# EAGLE design Arduino_EG (EAGLE 9.0.1)
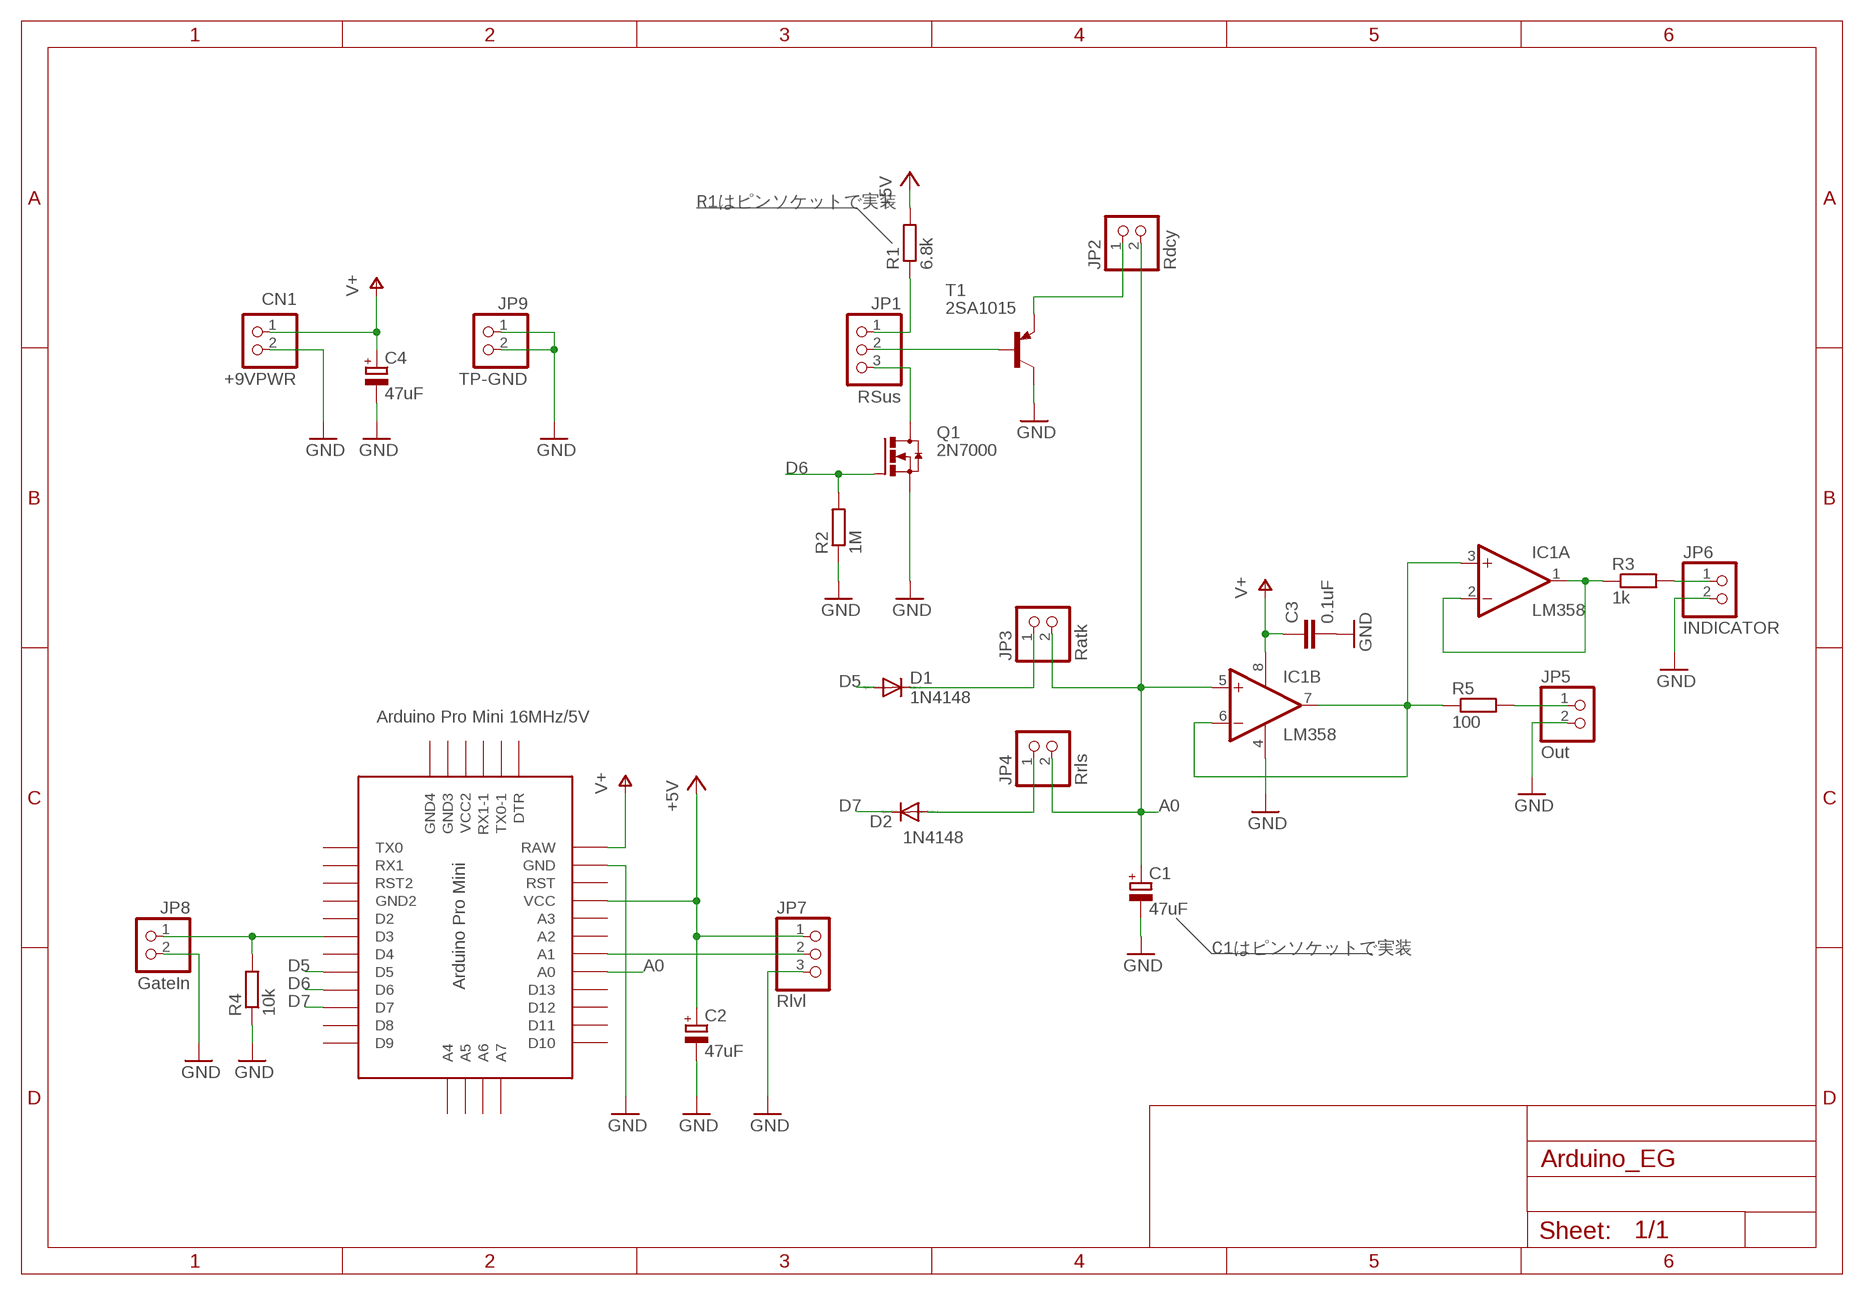
[diagram p0: schematic, sheet 1]

## Parts
C1  47uF  CPOL-EUE2.5-7  [E2,5-7]
C2  47uF  CPOL-EUE2.5-7  [E2,5-7]
C3  0.1uF  C-EU025-025X050  [C025-025X050]
C4  47uF  CPOL-EUE2.5-7  [E2,5-7]
CN1  +9VPWR  B2B-XH-A  [B2B-XH-A]
D1  1N4148  1N4148DO35-7  [DO35-7]
D2  1N4148  1N4148DO35-7  [DO35-7]
IC1  LM358  LM358N  [DIL08]
JP1  RSus  PINHD-1X3  [1X03]
JP2  Rdcy  PINHD-1X2  [1X02]
JP3  Ratk  PINHD-1X2  [1X02]
JP4  Rrls  PINHD-1X2  [1X02]
JP5  Out  PINHD-1X2  [1X02]
JP6  INDICATOR  PINHD-1X2  [1X02]
JP7  Rlvl  PINHD-1X3  [1X03]
JP8  GateIn  PINHD-1X2  [1X02]
JP9  TP-GND  PINHD-1X2  [1X02]
Q1  2N7000  [TO92-]
R1  6.8k  R-EU_0207/7  [0207/7]
R2  1M  R-EU_0207/7  [0207/7]
R3  1k  R-EU_0207/7  [0207/7]
R4  10k  R-EU_0207/7  [0207/7]
R5  100  R-EU_0207/7  [0207/7]
T1  2SA1015  -PNP-TO92-ECB  [TO92-ECB]
U$1  PRO-MINI  [PRO-MINI]

## Nets
+5V: C2.+ JP7.1 R1.2 U$1.VCC
A0: C1.+ IC1.5(B:+IN) JP2.2 JP3.2 JP4.2 U$1.A0
D5: D1.A U$1.D5
D6: Q1.2(G) R2.2 U$1.D6
D7: D2.C U$1.D7
GND: C1.- C2.- C3.2 C4.- CN1.2 IC1.4(P:V-) JP5.2 JP6.2 JP7.3 JP8.2 JP9.1 JP9.2 Q1.3(S) R2.1 R4.1 T1.C U$1.GND
N$1: JP1.1 R1.1
N$2: JP1.3 Q1.1(D)
N$3: JP1.2 T1.B
N$4: JP2.1 T1.E
N$5: JP5.1 R5.2
N$6: D1.C JP3.1
N$8: D2.A JP4.1
N$9: IC1.1(A:OUT) IC1.2(A:-IN) R3.1
N$10: JP7.2 U$1.A1
N$11: JP6.1 R3.2
N$13: JP8.1 R4.2 U$1.D3
OUT: IC1.3(A:+IN) IC1.6(B:-IN) IC1.7(B:OUT) R5.1
V+: C3.1 C4.+ CN1.1 IC1.8(P:V+) U$1.RAW
Unconnected: U$1.A2 U$1.A3 U$1.A4 U$1.A5 U$1.A6 U$1.A7 U$1.D2 U$1.D4 U$1.D8 U$1.D9 U$1.D10 U$1.D11 U$1.D12 U$1.D13 U$1.DTR U$1.GND1(GND2) U$1.GND2(GND4) U$1.GND3 U$1.RST U$1.RST1(RST2) U$1.RX1 U$1.RX1-1 U$1.TX0 U$1.TX0-1 U$1.VCC1(VCC2)

## Notes on the sheet
- R1はピンソケットで実装
- Arduino Pro Mini 16MHz/5V
- C1はピンソケットで実装

## Library data of the parts
C1 C2 C4 = rcl:CPOL-EU: POLARIZED CAPACITOR, European symbol; SPICEPREFIX: C
C3 = rcl:C-EU: CAPACITOR, European symbol; SPICEPREFIX: C
CN1 = jst-xh:B2B-XH-A: Wire-to-Board 2.5mm pitch top mount connector Source: http://www.jst-mfg.com/product/pdf/jpn/XH.pdf http://www.jst-mfg.com/product/detail.php?series=277
D1 D2 = diode:1N4148: DIODE high speed (Philips)
IC1 = linear:LM358: OP AMP also LM158; LM258; LM2904 Source: http://cache.national.com/ds/LM/LM158.pdf
JP1 JP7 = pinhead:PINHD-1X3: PIN HEADER
JP2-JP6 JP8 JP9 = pinhead:PINHD-1X2: PIN HEADER
Q1 = mylib2:2N7000: 2N7000 N-Channel Enhancement Mode Field Effect Transistor
R1-R5 = rcl:R-EU_: RESISTOR, European symbol; SPICEPREFIX: R
T1 = transistor-neu-to92:*-PNP-: PNP Transistror
U$1 = Arduino-clone:PRO-MINI: Arduion Pro Mini Clone V1.0 www.betemcu.cu

## Board
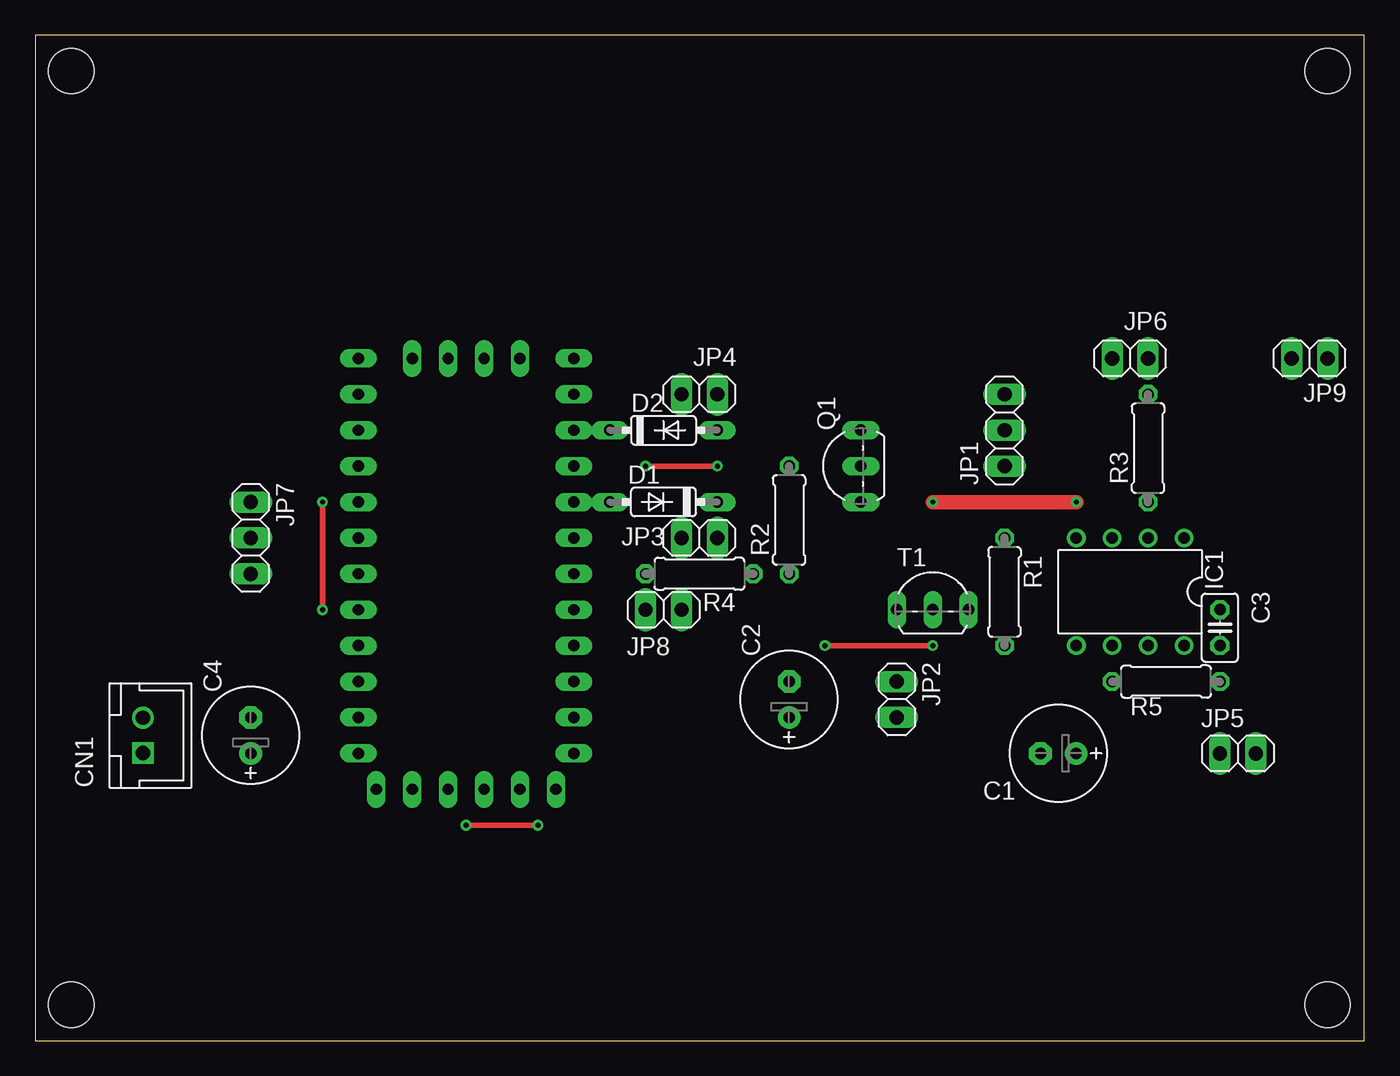
[diagram p1: board, top side]
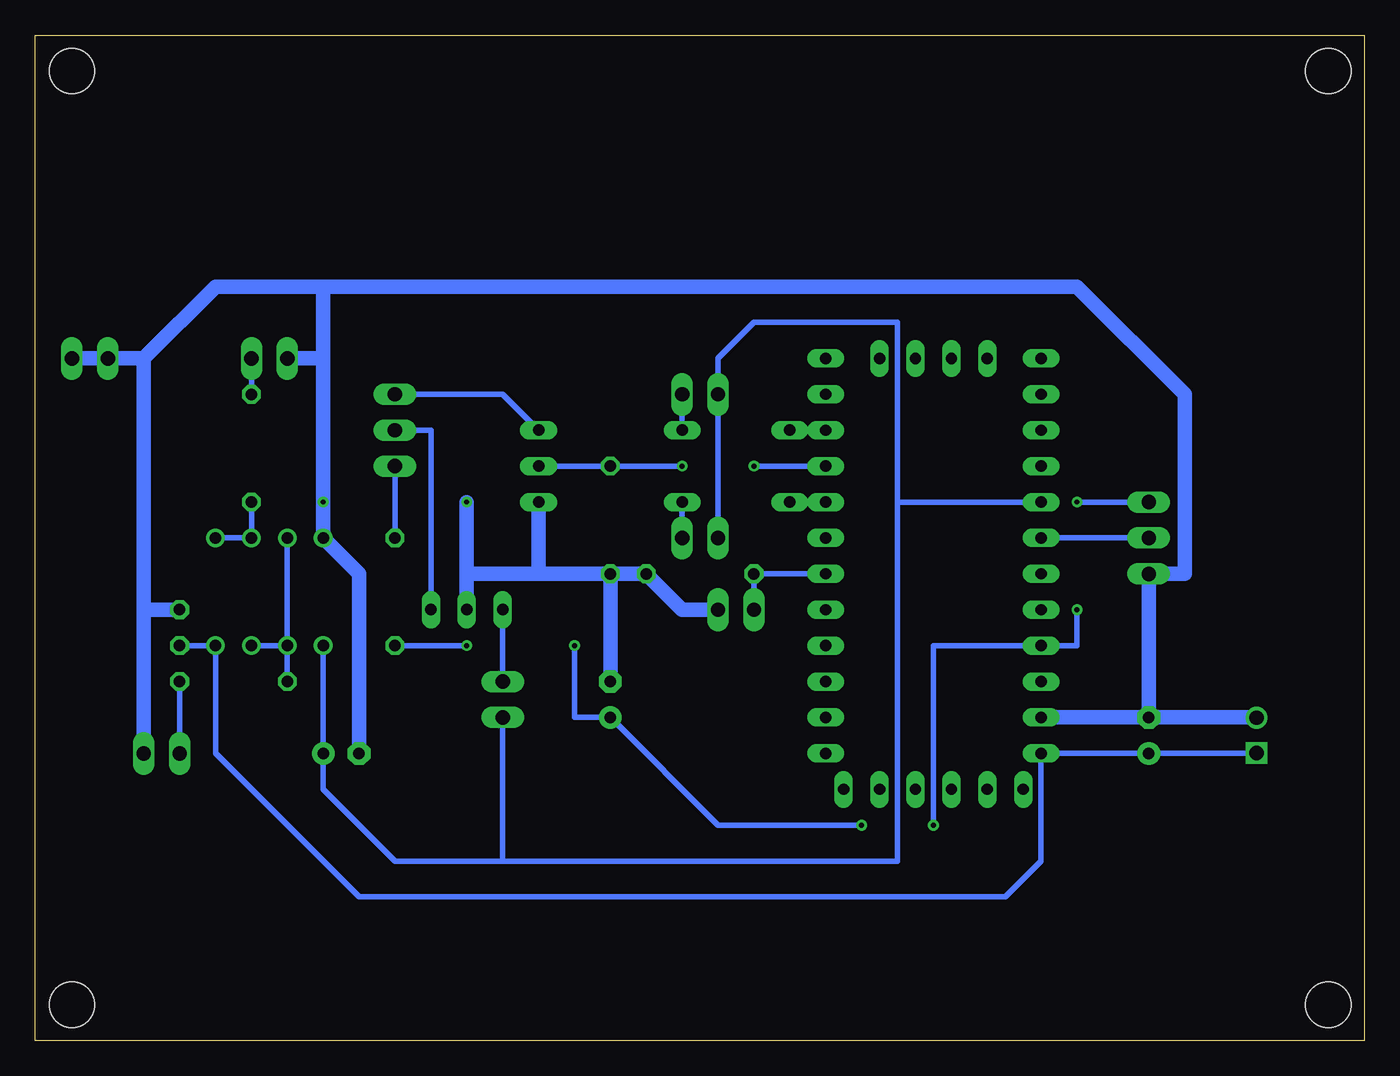
[diagram p2: board, bottom side, seen from below]

Size 94.03 x 71.11 mm. Coordinates in mm from the lower left corner, seen from the top.
Outline: 0,0 94.03,0 94.03,71.11 0,71.11 0,0
Copper layers (1*16): Top 0.035mm / dielectric 1.5mm / Bottom 0.035mm
Design rules "default": minimum track width 6mil, minimum drill 0.35mm, track to track 6mil, track to pad 6mil, pad to pad 6mil, via to via 6mil, smd to smd 6mil, copper to edge 40mil, drill to drill 6mil, minimum pad ring 10mil, minimum via ring 8mil, stop-mask expansion 4mil, vias tented up to drill 0mil, thermal gap 10mil
Holes 3.2 mm at 2.54,68.58 2.54,2.54 91.44,68.58 91.44,2.54

### Footprints (pad centres in the part's own frame; a part is rotated, then mirrored left to right if it is on the bottom)
E2,5-7 = drill 0.813 pad 1.6: + -1.27,0 | drill 0.813 pad 1.6 octagon: - 1.27,0
C025-025X050 = drill 0.813 octagon: 1 -1.27,0; 2 1.27,0
B2B-XH-A = drill 1.016 square: 1 -1.25,0 | drill 1.016: 2 1.25,0
DO35-7 = drill 0.813 long: A 3.81,0; C -3.81,0
DIL08 = drill 0.813 pad 1.27: 1 -3.81,-3.81; 2 -1.27,-3.81; 3 1.27,-3.81; 4 3.81,-3.81; 5 3.81,3.81; 6 1.27,3.81; 7 -1.27,3.81; 8 -3.81,3.81
1X03 = drill 1.016 long: 1 -2.54,0; 2 0,0; 3 2.54,0
1X02 = drill 1.016 long: 1 -1.27,0; 2 1.27,0
TO92- = drill 0.813 long: 1 2.54,0; 2 0,0; 3 -2.54,0
0207/7 = drill 0.813 octagon: 1 -3.81,0; 2 3.81,0
TO92-ECB = drill 0.813 long: B 2.54,0; C 0,0; E -2.54,0
PRO-MINI = drill 0.8 long: A0 8.89,8.89; A1 8.89,11.43; A2 8.89,13.97; A3 8.89,16.51; A4 -2.54,-1.27; A5 0,-1.27; A6 2.54,-1.27; A7 5.08,-1.27; D2 -6.35,16.51; D3 -6.35,13.97; D4 -6.35,11.43; D5 -6.35,8.89; D6 -6.35,6.35; D7 -6.35,3.81; D8 -6.35,1.27; D9 -6.35,-1.27; D10 8.89,-1.27; D11 8.89,1.27; D12 8.89,3.81; D13 8.89,6.35; DTR 7.62,29.21; GND 8.89,24.13; GND1 -6.35,19.05; GND2 -5.08,29.21; GND3 -2.54,29.21; RAW 8.89,26.67; RST 8.89,21.59; RST1 -6.35,21.59; RX1 -6.35,24.13; RX1-1 2.54,29.21; TX0 -6.35,26.67; TX0-1 5.08,29.21; VCC 8.89,19.05; VCC1 0,29.21

### Placement (x,y rotation side)
C1  72.39,20.32 180 top
C2  53.34,24.13 90 top
C3  83.82,29.21 90 top
C4  15.24,21.59 90 top
CN1  7.62,21.59 90 top
D1  44.45,38.1 180 top
D2  44.45,43.18 0 top
IC1  77.47,31.75 180 top
JP1  68.58,43.18 90 top
JP2  60.96,24.13 270 top
JP3  46.99,35.56 180 top
JP4  46.99,45.72 180 top
JP5  85.09,20.32 0 top
JP6  77.47,48.26 180 top
JP7  15.24,35.56 270 top
JP8  44.45,30.48 0 top
JP9  90.17,48.26 180 top
Q1  58.42,40.64 90 top
R1  68.58,31.75 270 top
R2  53.34,36.83 90 top
R3  78.74,41.91 90 top
R4  46.99,33.02 180 top
R5  80.01,25.4 0 top
T1  63.5,30.48 0 top
U$1  31.75,46.99 180 top

### Tracks (layer width: path | path; a pad name or v marks a point on that pad's centre or on a via)
+5V  (via drill 0.35)
  Top 0.406: v55.88,27.94 v63.5,27.94 | v20.32,38.1 v20.32,30.48 | v30.48,15.24 v35.56,15.24
  Bottom 0.406: v55.88,27.94 55.88,22.86 C2.+ 45.72,15.24 v35.56,15.24 | v63.5,27.94 R1.2 | JP7.1 v20.32,38.1 | v20.32,30.48 20.32,27.94 U$1.VCC 30.48,27.94 v30.48,15.24
A0
  Bottom 0.406: JP3.2 JP4.2 45.72,48.26 43.18,50.8 33.02,50.8 33.02,38.1 | IC1.5 C1.+ 73.66,17.78 68.58,12.7 60.96,12.7 | U$1.A0 33.02,38.1 | 33.02,38.1 33.02,12.7 60.96,12.7 | JP2.2 60.96,12.7
D5
  Bottom 0.406: U$1.D5 D1.A
D6  (via drill 0.35)
  Top 0.406: v43.18,40.64 v48.26,40.64
  Bottom 0.406: v48.26,40.64 R2.2 Q1.2 | U$1.D6 v43.18,40.64
D7
  Bottom 0.406: U$1.D7 D2.C
GND  (via drill 0.35)
  Top 1.016: v63.5,38.1 v73.66,38.1
  Bottom 1.016: R2.1 R4.1 48.26,30.48 JP8.2 | R2.1 C2.- | R2.1 58.42,33.02 | 58.42,33.02 63.5,33.02 | 63.5,33.02 T1.C | Q1.3 58.42,33.02 | 63.5,33.02 v63.5,38.1 | C1.- 71.12,33.02 IC1.4 v73.66,38.1 73.66,48.26 | 73.66,53.34 81.28,53.34 86.36,48.26 | 73.66,48.26 73.66,53.34 | JP6.2 73.66,48.26 | 73.66,53.34 20.32,53.34 12.7,45.72 12.7,33.02 JP7.3 C4.- | CN1.2 7.64,22.86 C4.- | C4.- U$1.GND | 86.36,48.26 JP9.2 JP9.1 | JP5.2 86.36,30.48 | 86.36,30.48 86.36,48.26 | C3.2 86.36,30.48
N$1
  Bottom 0.406: JP1.1 R1.1
N$2
  Bottom 0.406: JP1.3 60.96,45.72 Q1.1
N$3
  Bottom 0.406: T1.B 66.04,43.18 JP1.2
N$4
  Bottom 0.406: T1.E JP2.1
N$5
  Bottom 0.406: R5.2 JP5.1
N$6
  Bottom 0.406: D1.C JP3.1
N$8
  Bottom 0.406: JP4.1 D2.A
N$9
  Bottom 0.406: IC1.1 IC1.2 R3.1
N$10
  Bottom 0.406: U$1.A1 JP7.2
N$11
  Bottom 0.406: JP6.1 R3.2
N$13
  Bottom 0.406: JP8.1 R4.2 U$1.D3
OUT
  Bottom 0.406: R5.1 IC1.6 | IC1.6 IC1.7 | IC1.3 IC1.6
V+
  Bottom 0.406: C3.1 IC1.8 81.28,20.32 71.12,10.16 25.4,10.16 22.86,12.7 U$1.RAW C4.+ 15.22,20.34 CN1.1

### Text on the board
tTest: Arduino EG | http://dad8893.blogspot.com/
tDocu: はピンソケットで実装